# Altium project PROC099A.PrjPcb (part 2 of 3)

## Sheet PROC099A_SOP_Headers_Reference.SchDoc
size 431 x 279 mm; Date: Not shown in title block; ApprovedBy: Not shown in title block; CheckedBy: Not shown in title block; Author: Not shown in title block; CompanyName: Not shown in title block; DrawnBy: Adrian Ozer; Engineer: Not shown in title block; Organization: Not shown in title block; Address1: Not shown in title block; Address2: Not shown in title block; Address3: Not shown in title block; Address4: Not shown in title block; DocumentNumber: 6; Revision: Use project parameter SCH_Rev; SheetNumber: 6; SheetTotal: 16; PageSetup: Record=PageOptions|CenterHorizontal=True|CenterVertical=True|PrintScale=1.00|XCorrection=1.00|YCorrection=1.00|PrintKind=0|BorderSize=5000000|LeftOffset=0|BottomOffset=0|Orientation=2|PaperLength=1000|PaperWidth=1000|Scale=100|PaperSource=15|PrintQuality=600|MediaType=1|DitherType=10|PaperKind=Letter|PrintScaleMode=1; CurrentTime: Not shown in title block; CurrentDate: Not shown in title block; Time: Not shown in title block; DocumentFullPathAndName: Not shown in title block; DocumentName: Not shown in title block; ModifiedDate: Not shown in title block; ImagePath: Not shown in title block
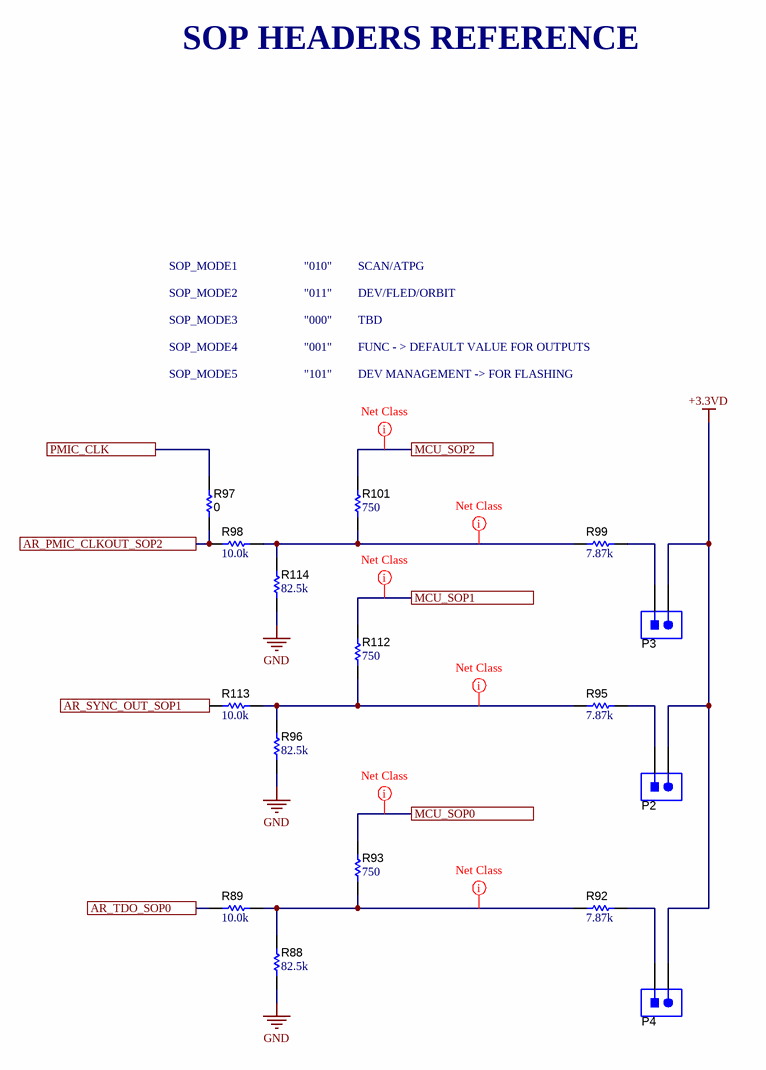
[diagram p4: PROC099A_SOP_Headers_Reference.SchDoc]

### Parts
P2  TSW-102-07-G-S  [TSW-102-07-G-S]  (value not drawn)
P3  TSW-102-07-G-S  [TSW-102-07-G-S]  (value not drawn)
P4  TSW-102-07-G-S  [TSW-102-07-G-S]  (value not drawn)
R88  ValueDisplayed: 82.5k  [0402L]  (hidden comment: CRCW040282K5FKED)
R89  ValueDisplayed: 10.0k  [0402L]  (hidden comment: CRCW040210K0FKED)
R92  ValueDisplayed: 7.87k  [0402L]  (hidden comment: CRCW04027K87FKED)
R93  ValueDisplayed: 750  [0402L]  (hidden comment: CRCW0402750RFKED)
R95  ValueDisplayed: 7.87k  [0402L]  (hidden comment: CRCW04027K87FKED)
R96  ValueDisplayed: 82.5k  [0402L]  (hidden comment: CRCW040282K5FKED)
R97  ValueDisplayed: 0  [0402L]  (hidden comment: ERJ-2GE0R00X)
R98  ValueDisplayed: 10.0k  [0402L]  (hidden comment: CRCW040210K0FKED)
R99  ValueDisplayed: 7.87k  [0402L]  (hidden comment: CRCW04027K87FKED)
R101  ValueDisplayed: 750  [0402L]  (hidden comment: CRCW0402750RFKED)
R112  ValueDisplayed: 750  [0402L]  (hidden comment: CRCW0402750RFKED)
R113  ValueDisplayed: 10.0k  [0402L]  (hidden comment: CRCW040210K0FKED)
R114  ValueDisplayed: 82.5k  [0402L]  (hidden comment: CRCW040282K5FKED)

### Ports
AR_PMIC_CLKOUT_SOP2, AR_SYNC_OUT_SOP1, AR_TDO_SOP0, MCU_SOP0, MCU_SOP1, MCU_SOP2, PMIC_CLK

### Nets
+3.3VD: P2.2 P3.2 P4.2
GND: R88.1 R96.1 R114.1
AR_PMIC_CLKOUT_SOP2: R97.1 R98.1 ; port AR_PMIC_CLKOUT_SOP2
AR_SYNC_OUT_SOP1: R113.1 ; port AR_SYNC_OUT_SOP1
AR_TDO_SOP0: R89.1 ; port AR_TDO_SOP0
MCU_SOP0: R93.2 ; port MCU_SOP0
MCU_SOP1: R112.2 ; port MCU_SOP1
MCU_SOP2: R101.2 ; port MCU_SOP2
PMIC_CLK: R97.2 ; port PMIC_CLK
NetP2_1: P2.1 R95.2
NetP3_1: P3.1 R99.2
NetP4_1: P4.1 R92.2
NetR88_2: R88.2 R89.2 R92.1 R93.1
NetR95_1: R95.1 R96.2 R112.1 R113.2
NetR98_2: R98.2 R99.1 R101.1 R114.2

### Layout directives
net class GENERAL: MCU_SOP0, MCU_SOP1, MCU_SOP2, NetR88_2, NetR95_1, NetR98_2

### Notes on the sheet
- SOP HEADERS REFERENCE
- SOP_MODE1
- "010"
- SCAN/ATPG
- SOP_MODE2
- SOP_MODE3
- "011"
- "000"
- DEV/FLED/ORBIT
- TBD
- SOP_MODE4
- SOP_MODE5
- "001"
- "101"
- FUNC - > DEFAULT VALUE FOR OUTPUTS
- DEV MANAGEMENT -> FOR FLASHING
- Drawn By:
- SVN Rev:
- Number:
- TID #:
- Orderable:
- Rev:
- Sheet Title:
- File:
- Project Title:
- Designed for:
- Assembly Variant:
- Mod. Date:
- Sheet:
- Size:
- of
- B
- http://www.ti.com
- Texas Instruments and/or its licensors do not warrant the accuracy or completeness of this specification or any information contained therein. Texas Instruments and/or its licensors do not warrant that this design will meet the specifications, will be suitable for your application or fit for any particular purpose, or will operate in an implementation. Texas Instruments and/or its licensors do not warrant that the design is production worthy. You should completely validate and test your design implementation to confirm the system functionality for your application.
- Engineer:
- Contact:
- © Texas Instruments

### Library data of the parts
P2-P4 = CMP-0075405-2: Header, 100mil, 2x1, Gold, TH; Manufacturer: Samtec; Pitch_mm: 2.54; Cert_VDE: N; Gender: Male; Cert_CSA: Y; Voltage_V: 550V; Green_REACh: Passed; Current_A: 6.3A; Green_Lifecycle: Active; Row_Count: 1; ComponentLink1Description: Datasheet URL; RoHS: Y; Supplier 1: Digi-Key; Cert_UL: Y; Orientation: Vertical; Green_EU RoHS: Passed; PackageReference: 2x1 Header; Color: Black; PartNumber: TSW-102-07-G-S; PinCount: 2; ContactFinish: Gold; Cert_CULUS: N; Shrouded: N; ClassName: Header; ComponentLink1URL: http://samtec.com/ftppub/pdf/TSW_TH.PDF; CompType: Header; MountType: TH; Supplier Part Number 1: SAM1029-02-ND; Green_EU RoHS-2: Passed
R88 R96 = CMP-0026574-2: RES, 82.5 k, 1%, 0.063 W, AEC-Q200 Grade 0, 0402; Manufacturer: Vishay-Dale; Power_W: 63mW; TempCo: 100 ppm/C; Value_Code: 82k5; Value: 82.5k; EIA_Code: E96; SizeX_mm: 1; SizeY_mm: 0.5; SizeZ_mm: 0.6; Value2: 0.063W; AEC Qualified: Y; VDC_V: 50V; AEC Grade: 0; AEC Category: Q200; ComponentLink1URL: http://www.vishay.com/docs/20035/dcrcwe3.pdf; Supplier Part Number 2: 52K7304; Supplier 2: Newark; Supplier Part Number 3: 71-CRCW0402-82.5K-E3; Supplier 3: Mouser; RoHS: E; Value1: 1%; MountType: SMT; Supplier 1: Digi-Key; PackageReference: 0402; Tolerance_%: 1%; Res_ohm: 82.5k; SizeArea_mm2: 0.5; CompType: Resistor; PartNumber: CRCW040282K5FKED; ComponentLink1Description: Datasheet link; Supplier Part Number 1: 541-82.5KLCT-ND; Technology: Thick Film
R89 R98 R113 = CMP-0025958-3: RES, 10.0 k, 1%, 0.063 W, AEC-Q200 Grade 0, 0402; Manufacturer: Vishay-Dale; Power_W: 63mW; TempCo: 100 ppm/C; Value_Code: 10k0; Value: 10.0k; EIA_Code: E96; Res_ohm: 10k; SizeX_mm: 1; SizeY_mm: 0.5; SizeZ_mm: 0.6; Value2: 0.063W; CompType: Resistor; AEC Qualified: Y; VDC_V: 50V; AEC Category: Q200; AEC Grade: 0; Supplier Part Number 2: 52K6595; Supplier 2: Newark; Supplier Part Number 3: 71-CRCW0402-10K-E3; Supplier 3: Mouser; RoHS: E; Value1: 1%; MountType: SMT; Supplier 1: Digi-Key; PackageReference: 0402; Tolerance_%: 1%; SizeArea_mm2: 0.5; PartNumber: CRCW040210K0FKED; ComponentLink1Description: Datasheet link; Supplier Part Number 1: 541-10.0KLCT-ND; Technology: Thick Film; ComponentLink1URL: http://www.vishay.com/docs/20035/dcrcwe3.pdf
R92 R95 R99 = CMP-0026557-2: RES, 7.87 k, 1%, 0.063 W, AEC-Q200 Grade 0, 0402; Manufacturer: Vishay-Dale; Power_W: 63mW; TempCo: 100 ppm/C; Value_Code: 7k87; Value: 7.87k; EIA_Code: E96; SizeX_mm: 1; SizeY_mm: 0.5; SizeZ_mm: 0.6; Value2: 0.063W; AEC Qualified: Y; VDC_V: 50V; AEC Grade: 0; AEC Category: Q200; ComponentLink1URL: http://www.vishay.com/docs/20035/dcrcwe3.pdf; Supplier Part Number 2: 52K7249; Supplier 2: Newark; Supplier Part Number 3: 71-CRCW0402-7.87K-E3; Supplier 3: Mouser; RoHS: E; Value1: 1%; MountType: SMT; Supplier 1: Digi-Key; PackageReference: 0402; Tolerance_%: 1%; Res_ohm: 7.87k; SizeArea_mm2: 0.5; CompType: Resistor; PartNumber: CRCW04027K87FKED; ComponentLink1Description: Datasheet link; Supplier Part Number 1: 541-7.87KLCT-ND; Technology: Thick Film
R93 R112 = CMP-0026542-2: RES, 750, 1%, 0.063 W, AEC-Q200 Grade 0, 0402; Manufacturer: Vishay-Dale; Power_W: 63mW; TempCo: 100 ppm/C; Value_Code: 750R; Value: 750; EIA_Code: E96; SizeX_mm: 1; SizeY_mm: 0.5; SizeZ_mm: 0.6; Value2: 0.063W; AEC Qualified: Y; VDC_V: 50V; AEC Grade: 0; AEC Category: Q200; ComponentLink1URL: http://www.vishay.com/docs/20035/dcrcwe3.pdf; Supplier Part Number 2: 52K7270; Supplier 2: Newark; Supplier Part Number 3: 71-CRCW0402-750-E3; Supplier 3: Mouser; RoHS: E; Value1: 1%; MountType: SMT; Supplier 1: Digi-Key; PackageReference: 0402; Tolerance_%: 1%; Res_ohm: 750; SizeArea_mm2: 0.5; CompType: Resistor; PartNumber: CRCW0402750RFKED; ComponentLink1Description: Datasheet link; Supplier Part Number 1: 541-750LCT-ND; Technology: Thick Film
R97 = CMP-0026992-2: RES, 0, 5%, 0.063 W, 0402; Manufacturer: Panasonic; Power_W: 63mW; TempCo: 600 ppm/C; Value_Code: 0000; U/M: EA; Value: 0; EIA_Code: E24; SizeX_mm: 1; SizeY_mm: 0.5; SizeZ_mm: 0.6; Value2: 0.063W; CompType: Resistor; VDC_V: 50V; AEC Category: Q200; INSTALATION: DNP; Supplier Part Number 2: 65T8307; Publisher: Texas Instruments; Supplier 2: Newark; Supplier Part Number 3: 667-ERJ-2GE0R00X; Supplier 3: Mouser; Published: 2008-06-26; RoHS: Y; Value1: 5%; MountType: SMT; Supplier 1: Digi-Key; PackageReference: 0402; Tolerance_%: 5%; Res_ohm: 0; SizeArea_mm2: 0.5; LatestRevisionDate: 2017-03-09; PartNumber: ERJ-2GE0R00X; AEC Qualified: ?; ComponentLink1Description: Datasheet link; Supplier Part Number 1: P0.0JCT-ND; Technology: Thick Film; ComponentLink1URL: http://www.panasonic.com/industrial/components/pdf/AOA0000CE1.pdf
R101 = CMP-0026542-2: RES, 750, 1%, 0.063 W, AEC-Q200 Grade 0, 0402; Manufacturer: Vishay-Dale; Power_W: 63mW; TempCo: 100 ppm/C; Value_Code: 750R; Value: 750; EIA_Code: E96; SizeX_mm: 1; SizeY_mm: 0.5; SizeZ_mm: 0.6; Value2: 0.063W; CompType: Resistor; AEC Qualified: Y; VDC_V: 50V; AEC Grade: 0; AEC Category: Q200; ComponentLink1URL: http://www.vishay.com/docs/20035/dcrcwe3.pdf; Supplier Part Number 2: 52K7270; Supplier 2: Newark; Supplier Part Number 3: 71-CRCW0402-750-E3; Supplier 3: Mouser; RoHS: E; Value1: 1%; MountType: SMT; Supplier 1: Digi-Key; PackageReference: 0402; Tolerance_%: 1%; Res_ohm: 750; SizeArea_mm2: 0.5; PartNumber: CRCW0402750RFKED; ComponentLink1Description: Datasheet link; Supplier Part Number 1: 541-750LCT-ND; Technology: Thick Film
R114 = CMP-0026574-2: RES, 82.5 k, 1%, 0.063 W, AEC-Q200 Grade 0, 0402; Manufacturer: Vishay-Dale; Power_W: 63mW; TempCo: 100 ppm/C; Value_Code: 82k5; Value: 82.5k; EIA_Code: E96; SizeX_mm: 1; SizeY_mm: 0.5; SizeZ_mm: 0.6; Value2: 0.063W; CompType: Resistor; AEC Qualified: Y; VDC_V: 50V; AEC Grade: 0; AEC Category: Q200; ComponentLink1URL: http://www.vishay.com/docs/20035/dcrcwe3.pdf; Supplier Part Number 2: 52K7304; Supplier 2: Newark; Supplier Part Number 3: 71-CRCW0402-82.5K-E3; Supplier 3: Mouser; RoHS: E; Value1: 1%; MountType: SMT; Supplier 1: Digi-Key; PackageReference: 0402; Tolerance_%: 1%; Res_ohm: 82.5k; SizeArea_mm2: 0.5; PartNumber: CRCW040282K5FKED; ComponentLink1Description: Datasheet link; Supplier Part Number 1: 541-82.5KLCT-ND; Technology: Thick Film

## Sheet PROC099A_QSPI_Flash_Reference.SchDoc: QSPI flash section
size 431 x 279 mm; Date: Not shown in title block; ApprovedBy: Not shown in title block; CheckedBy: Not shown in title block; Author: Not shown in title block; CompanyName: Not shown in title block; DrawnBy: Adrian Ozer; Engineer: Not shown in title block; Organization: Not shown in title block; Address1: Not shown in title block; Address2: Not shown in title block; Address3: Not shown in title block; Address4: Not shown in title block; DocumentNumber: 7; Revision: Use project parameter SCH_Rev; SheetNumber: 7; SheetTotal: 16; PageSetup: Record=PageOptions|CenterHorizontal=True|CenterVertical=True|PrintScale=1.00|XCorrection=1.00|YCorrection=1.00|PrintKind=0|BorderSize=5000000|LeftOffset=0|BottomOffset=0|Orientation=2|PaperLength=1000|PaperWidth=1000|Scale=100|PaperSource=15|PrintQuality=600|MediaType=1|DitherType=10|PaperKind=Letter|PrintScaleMode=1; CurrentTime: Not shown in title block; CurrentDate: Not shown in title block; Time: Not shown in title block; DocumentFullPathAndName: Not shown in title block; DocumentName: Not shown in title block; ModifiedDate: Not shown in title block; ImagePath: Not shown in title block
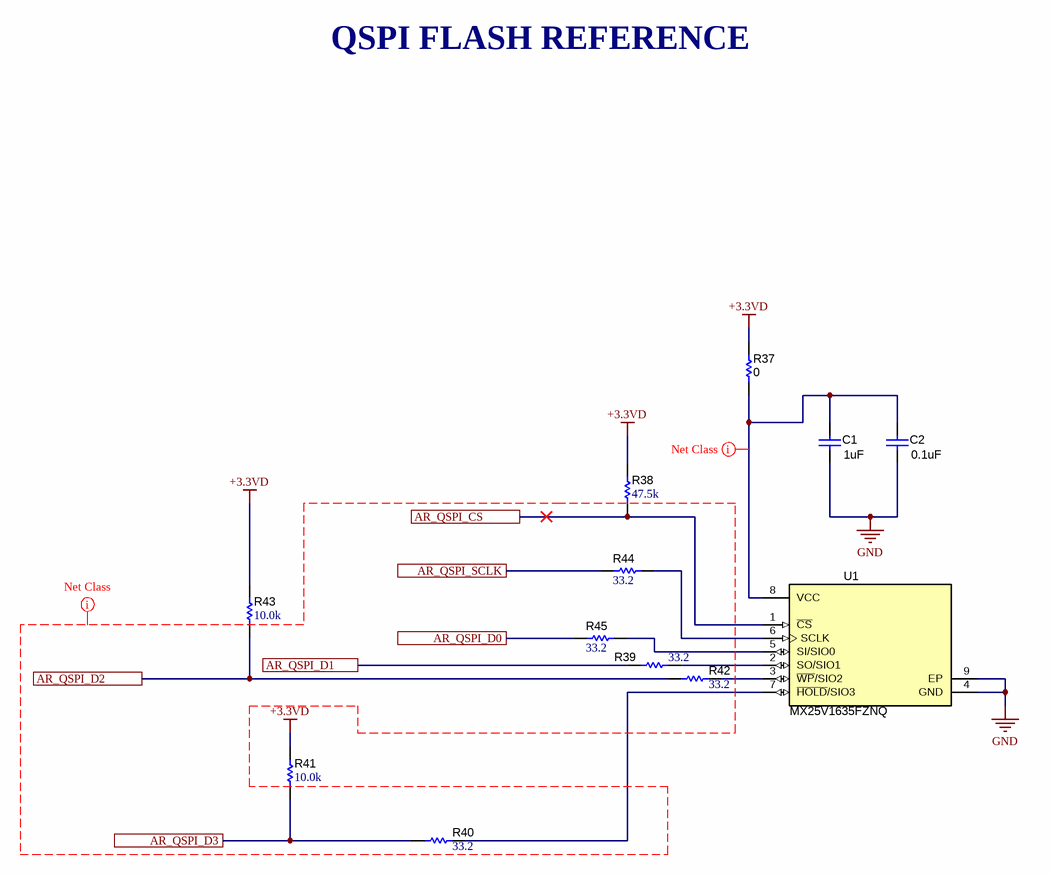
[diagram p5: PROC099A_QSPI_Flash_Reference.SchDoc]

### Parts
C1  ValueDisplayed: 1uF  [0603]  (hidden comment: GCM188R71C105KA64D)
C2  ValueDisplayed: 0.1uF  [0402L]  (hidden comment: CGA2B3X7R1H104K050BB)
R37  ValueDisplayed: 0  [0402L]  (hidden comment: ERJ-2GE0R00X)
R38  ValueDisplayed: 47.5k  [0402L]  (hidden comment: CRCW040247K5FKED)
R39  ValueDisplayed: 33.2  [0201_Silk]  (hidden comment: CRCW020133R2FNED)
R40  ValueDisplayed: 33.2  [0201_Silk]  (hidden comment: CRCW020133R2FNED)
R41  ValueDisplayed: 10.0k  [0402L]  (hidden comment: CRCW040210K0FKED)
R42  ValueDisplayed: 33.2  [0201_Silk]  (hidden comment: CRCW020133R2FNED)
R43  ValueDisplayed: 10.0k  [0402L]  (hidden comment: CRCW040210K0FKED)
R44  ValueDisplayed: 33.2  [0201_Silk]  (hidden comment: CRCW020133R2FNED)
R45  ValueDisplayed: 33.2  [0201_Silk]  (hidden comment: CRCW020133R2FNED)
U1  MX25V1635FZNQ  [WSON-8L_6x5MM_EP]

### Ports
AR_QSPI_CS, AR_QSPI_D0, AR_QSPI_D1, AR_QSPI_D2, AR_QSPI_D3, AR_QSPI_SCLK

### Nets
+3.3VD: R37.1 R38.2 R41.2 R43.2
GND: C1.1 C2.1 U1.4(GND) U1.9(EP)
AR_QSPI_CS: R38.1 U1.1(~{CS}) ; port AR_QSPI_CS
AR_QSPI_D0: R45.2 ; port AR_QSPI_D0
AR_QSPI_D1: R39.1 ; port AR_QSPI_D1
AR_QSPI_D2: R42.1 R43.1 ; port AR_QSPI_D2
AR_QSPI_D3: R40.2 R41.1 ; port AR_QSPI_D3
AR_QSPI_SCLK: R44.2 ; port AR_QSPI_SCLK
NetC1_2: C1.2 C2.2 R37.2 U1.8(VCC)
NetR39_2: R39.2 U1.2(SO/SIO1)
NetR40_1: R40.1 U1.7(~{HOLD}/SIO3)
NetR42_2: R42.2 U1.3(~{WP}/SIO2)
NetR44_1: R44.1 U1.6(SCLK)
NetR45_1: R45.1 U1.5(SI/SIO0)

### Layout directives
net class PWR: NetC1_2
net class QSPI: +3.3VD

### Notes on the sheet
- QSPI FLASH REFERENCE
- Drawn By:
- SVN Rev:
- Number:
- TID #:
- Orderable:
- Rev:
- Sheet Title:
- File:
- Project Title:
- Designed for:
- Assembly Variant:
- Mod. Date:
- Sheet:
- Size:
- of
- B
- http://www.ti.com
- Texas Instruments and/or its licensors do not warrant the accuracy or completeness of this specification or any information contained therein. Texas Instruments and/or its licensors do not warrant that this design will meet the specifications, will be suitable for your application or fit for any particular purpose, or will operate in an implementation. Texas Instruments and/or its licensors do not warrant that the design is production worthy. You should completely validate and test your design implementation to confirm the system functionality for your application.
- Engineer:
- Contact:
- © Texas Instruments

### Library data of the parts
C1 = CMP-0007136-5: CAP, CERM, 1 uF, 16 V, +/- 10%, X7R, AEC-Q200 Grade 1, 0603; Manufacturer: MuRata; TaMin_C: -55°C; Polarized: N; SizeAreaWB_mm2: 4.68; Value1: Unknown; U/M: EA; Value: 1uF; TaMax_C: 125°C; SizeZ_mm: 1; SizeX_mm: 1.6; SizeY_mm: 0.8; Value2: 16V; SizeArea_mm2: 1.28; AEC Qualified: Y; Cap_F: 1µF; AEC Category: Q200; Supplier Part Number 2: 81-GCM188R71C105K64D; Publisher: Texas Instruments; Supplier 2: Mouser; TempCo: X7R; Published: 2008-06-19; RoHS: Y; MountType: SMT; Supplier 1: Digi-Key; PackageReference: 0603; Tolerance_%: 10%; Cap_Case: 0603; CompType: Capacitor; LatestRevisionDate: 2017-03-09; PartNumber: GCM188R71C105KA64D; VDC_V: 16V; ComponentLink1Description: Datasheet link; AEC Grade: 1; Supplier Part Number 1: 490-5241-6-ND; Technology: Ceramic; ComponentLink1URL: http://psearch.en.murata.com/capacitor/product/GCM188R71C105KA64%23.pdf
C2 = CMP-0006325-2: CAP, CERM, 0.1 uF, 50 V, +/- 10%, X7R, AEC-Q200 Grade 1, 0402; Manufacturer: TDK; TaMin_C: -55°C; ESR_ohm: 0.039064; Polarized: N; SizeAreaWB_mm2: 3; Value1: 0.039064 ohm; U/M: EA; Value: 0.1uF; TaMax_C: 125°C; SizeZ_mm: 0.6; SizeX_mm: 1; SizeY_mm: 0.5; Cap_Case: 0402; Value2: 50V; AEC Qualified: Y; Cap_F: 100nF; IRMS_A: 8.14669dA; AEC Category: Q200; Supplier Part Number 2: 04X3148; Publisher: Texas Instruments; Supplier 2: Newark; Supplier Part Number 3: 810-CGA2B3X7R1H104K; TempCo: X7R; Supplier 3: Mouser; Published: 2008-06-19; RoHS: Y; MountType: SMT; Supplier 1: Digi-Key; PackageReference: 0402; Tolerance_%: 10%; SizeArea_mm2: 0.5; CompType: Capacitor; LatestRevisionDate: 2017-03-09; PartNumber: CGA2B3X7R1H104K050BB; VDC_V: 50V; ComponentLink1Description: Datasheet link; AEC Grade: 1; Supplier Part Number 1: 445-6899-1-ND; Technology: Ceramic; ComponentLink1URL: https://product.tdk.com/en/search/capacitor/ceramic/mlcc/info?part_no=CGA2B3X7R1H104K050BB
R37 = CMP-0026992-2: RES, 0, 5%, 0.063 W, 0402; Manufacturer: Panasonic; Power_W: 63mW; TempCo: 600 ppm/C; Value_Code: 0000; U/M: EA; Value: 0; EIA_Code: E24; SizeX_mm: 1; SizeY_mm: 0.5; SizeZ_mm: 0.6; Value2: 0.063W; VDC_V: 50V; AEC Category: Q200; Supplier Part Number 2: 65T8307; Publisher: Texas Instruments; Supplier 2: Newark; Supplier Part Number 3: 667-ERJ-2GE0R00X; Supplier 3: Mouser; Published: 2008-06-26; RoHS: Y; Value1: 5%; MountType: SMT; Supplier 1: Digi-Key; PackageReference: 0402; Tolerance_%: 5%; Res_ohm: 0; SizeArea_mm2: 0.5; CompType: Resistor; LatestRevisionDate: 2017-03-09; PartNumber: ERJ-2GE0R00X; AEC Qualified: ?; ComponentLink1Description: Datasheet link; Supplier Part Number 1: P0.0JCT-ND; Technology: Thick Film; ComponentLink1URL: http://www.panasonic.com/industrial/components/pdf/AOA0000CE1.pdf
R38 = CMP-0026395-2: RES, 47.5 k, 1%, 0.063 W, AEC-Q200 Grade 0, 0402; Manufacturer: Vishay-Dale; Power_W: 63mW; TempCo: 100 ppm/C; Value_Code: 47k5; Value: 47.5k; EIA_Code: E96; SizeX_mm: 1; SizeY_mm: 0.5; SizeZ_mm: 0.6; Value2: 0.063W; AEC Qualified: Y; VDC_V: 50V; AEC Category: Q200; AEC Grade: 0; ComponentLink1URL: http://www.vishay.com/docs/20035/dcrcwe3.pdf; Supplier Part Number 2: 52K7100; Supplier 2: Newark; Supplier Part Number 3: 71-CRCW0402-47.5K-E3; Supplier 3: Mouser; RoHS: E; Value1: 1%; MountType: SMT; Supplier 1: Digi-Key; PackageReference: 0402; Tolerance_%: 1%; Res_ohm: 47.5k; SizeArea_mm2: 0.5; CompType: Resistor; PartNumber: CRCW040247K5FKED; ComponentLink1Description: Datasheet link; Supplier Part Number 1: 541-47.5KLCT-ND; Technology: Thick Film
R39 R40 R42 R44 R45 = CMP-0027275-3: RES, 33.2, 1%, 0.05 W, 0201; Manufacturer: Vishay-Dale; Power_W: 50mW; TempCo: 200 ppm/C; Value_Code: 33R2; Value: 33.2; EIA_Code: E96; SizeX_mm: 0.6; SizeY_mm: 0.3; SizeZ_mm: 0.26; Value2: 0.05W; SizeArea_mm2: 0.18; AEC Qualified: N; AEC Category: Q200; Supplier Part Number 2: 26W8649; Supplier 2: Newark; Supplier Part Number 3: 71-CRCW020133R2FNED; Supplier 3: Mouser; RoHS: E; Value1: 1%; MountType: SMT; Supplier 1: Digi-Key; PackageReference: 0201; Tolerance_%: 1%; Res_ohm: 33.2; CompType: Resistor; PartNumber: CRCW020133R2FNED; ComponentLink1Description: Datasheet link; AEC Grade: N/A; Supplier Part Number 1: 541-33.2ABCT-ND; Technology: Thick Film; ComponentLink1URL: http://www.vishay.com/docs/20052/crcw0201e3.pdf
R41 R43 = CMP-0025958-3: RES, 10.0 k, 1%, 0.063 W, AEC-Q200 Grade 0, 0402; Manufacturer: Vishay-Dale; Power_W: 63mW; TempCo: 100 ppm/C; Value_Code: 10k0; Value: 10.0k; EIA_Code: E96; Res_ohm: 10k; SizeX_mm: 1; SizeY_mm: 0.5; SizeZ_mm: 0.6; Value2: 0.063W; AEC Qualified: Y; VDC_V: 50V; AEC Category: Q200; AEC Grade: 0; Supplier Part Number 2: 52K6595; Supplier 2: Newark; Supplier Part Number 3: 71-CRCW0402-10K-E3; Supplier 3: Mouser; RoHS: E; Value1: 1%; MountType: SMT; Supplier 1: Digi-Key; PackageReference: 0402; Tolerance_%: 1%; SizeArea_mm2: 0.5; CompType: Resistor; PartNumber: CRCW040210K0FKED; ComponentLink1Description: Datasheet link; Supplier Part Number 1: 541-10.0KLCT-ND; Technology: Thick Film; ComponentLink1URL: http://www.vishay.com/docs/20035/dcrcwe3.pdf
U1 = CMP-0079267-1: 2.3V-3.6V, 16M-BIT [x 1/x 2/x 4] CMOS FLASH Memory, WSON-8; Manufacturer: Macronix International Co., LTD; SizeArea_mm2: 30; SizeAreaWB_mm2: 56; SizeY_mm: 5; SizeZ_mm: 0.8; SizeX_mm: 6; PartNumber: MX25V1635FZNQ; PackageReference: WSON-8; Supplier Part Number 1: 1092-1211-ND; ComponentLink1Description: Datasheet URL; MountType: SMT; ComponentLink1URL: http://www.macronix.com/Lists/Datasheet/Attachments/6724/MX25V1635F,%202.5V,%2016Mb,%20v1.4.pdf; Supplier 1: Digi-Key; RoHS: Y

## Sheet PROC099A_HD Connector.SchDoc: HD Connector
size 431 x 279 mm; Date: Not shown in title block; ApprovedBy: Not shown in title block; CheckedBy: Not shown in title block; Author: Not shown in title block; CompanyName: Not shown in title block; DrawnBy: Adrian Ozer; Engineer: Not shown in title block; Organization: Not shown in title block; Address1: Not shown in title block; Address2: Not shown in title block; Address3: Not shown in title block; Address4: Not shown in title block; DocumentNumber: 10; Revision: Use project parameter SCH_Rev; SheetNumber: 10; SheetTotal: 16; PageSetup: Record=PageOptions|CenterHorizontal=True|CenterVertical=True|PrintScale=1.00|XCorrection=1.00|YCorrection=1.00|PrintKind=0|BorderSize=5000000|LeftOffset=0|BottomOffset=0|Orientation=2|PaperLength=1000|PaperWidth=1000|Scale=100|PaperSource=15|PrintQuality=600|MediaType=1|DitherType=10|PrintScaleMode=1|PaperKind=Letter; CurrentTime: Not shown in title block; CurrentDate: Not shown in title block; Time: Not shown in title block; DocumentFullPathAndName: Not shown in title block; DocumentName: Not shown in title block; ModifiedDate: Not shown in title block; ImagePath: Not shown in title block
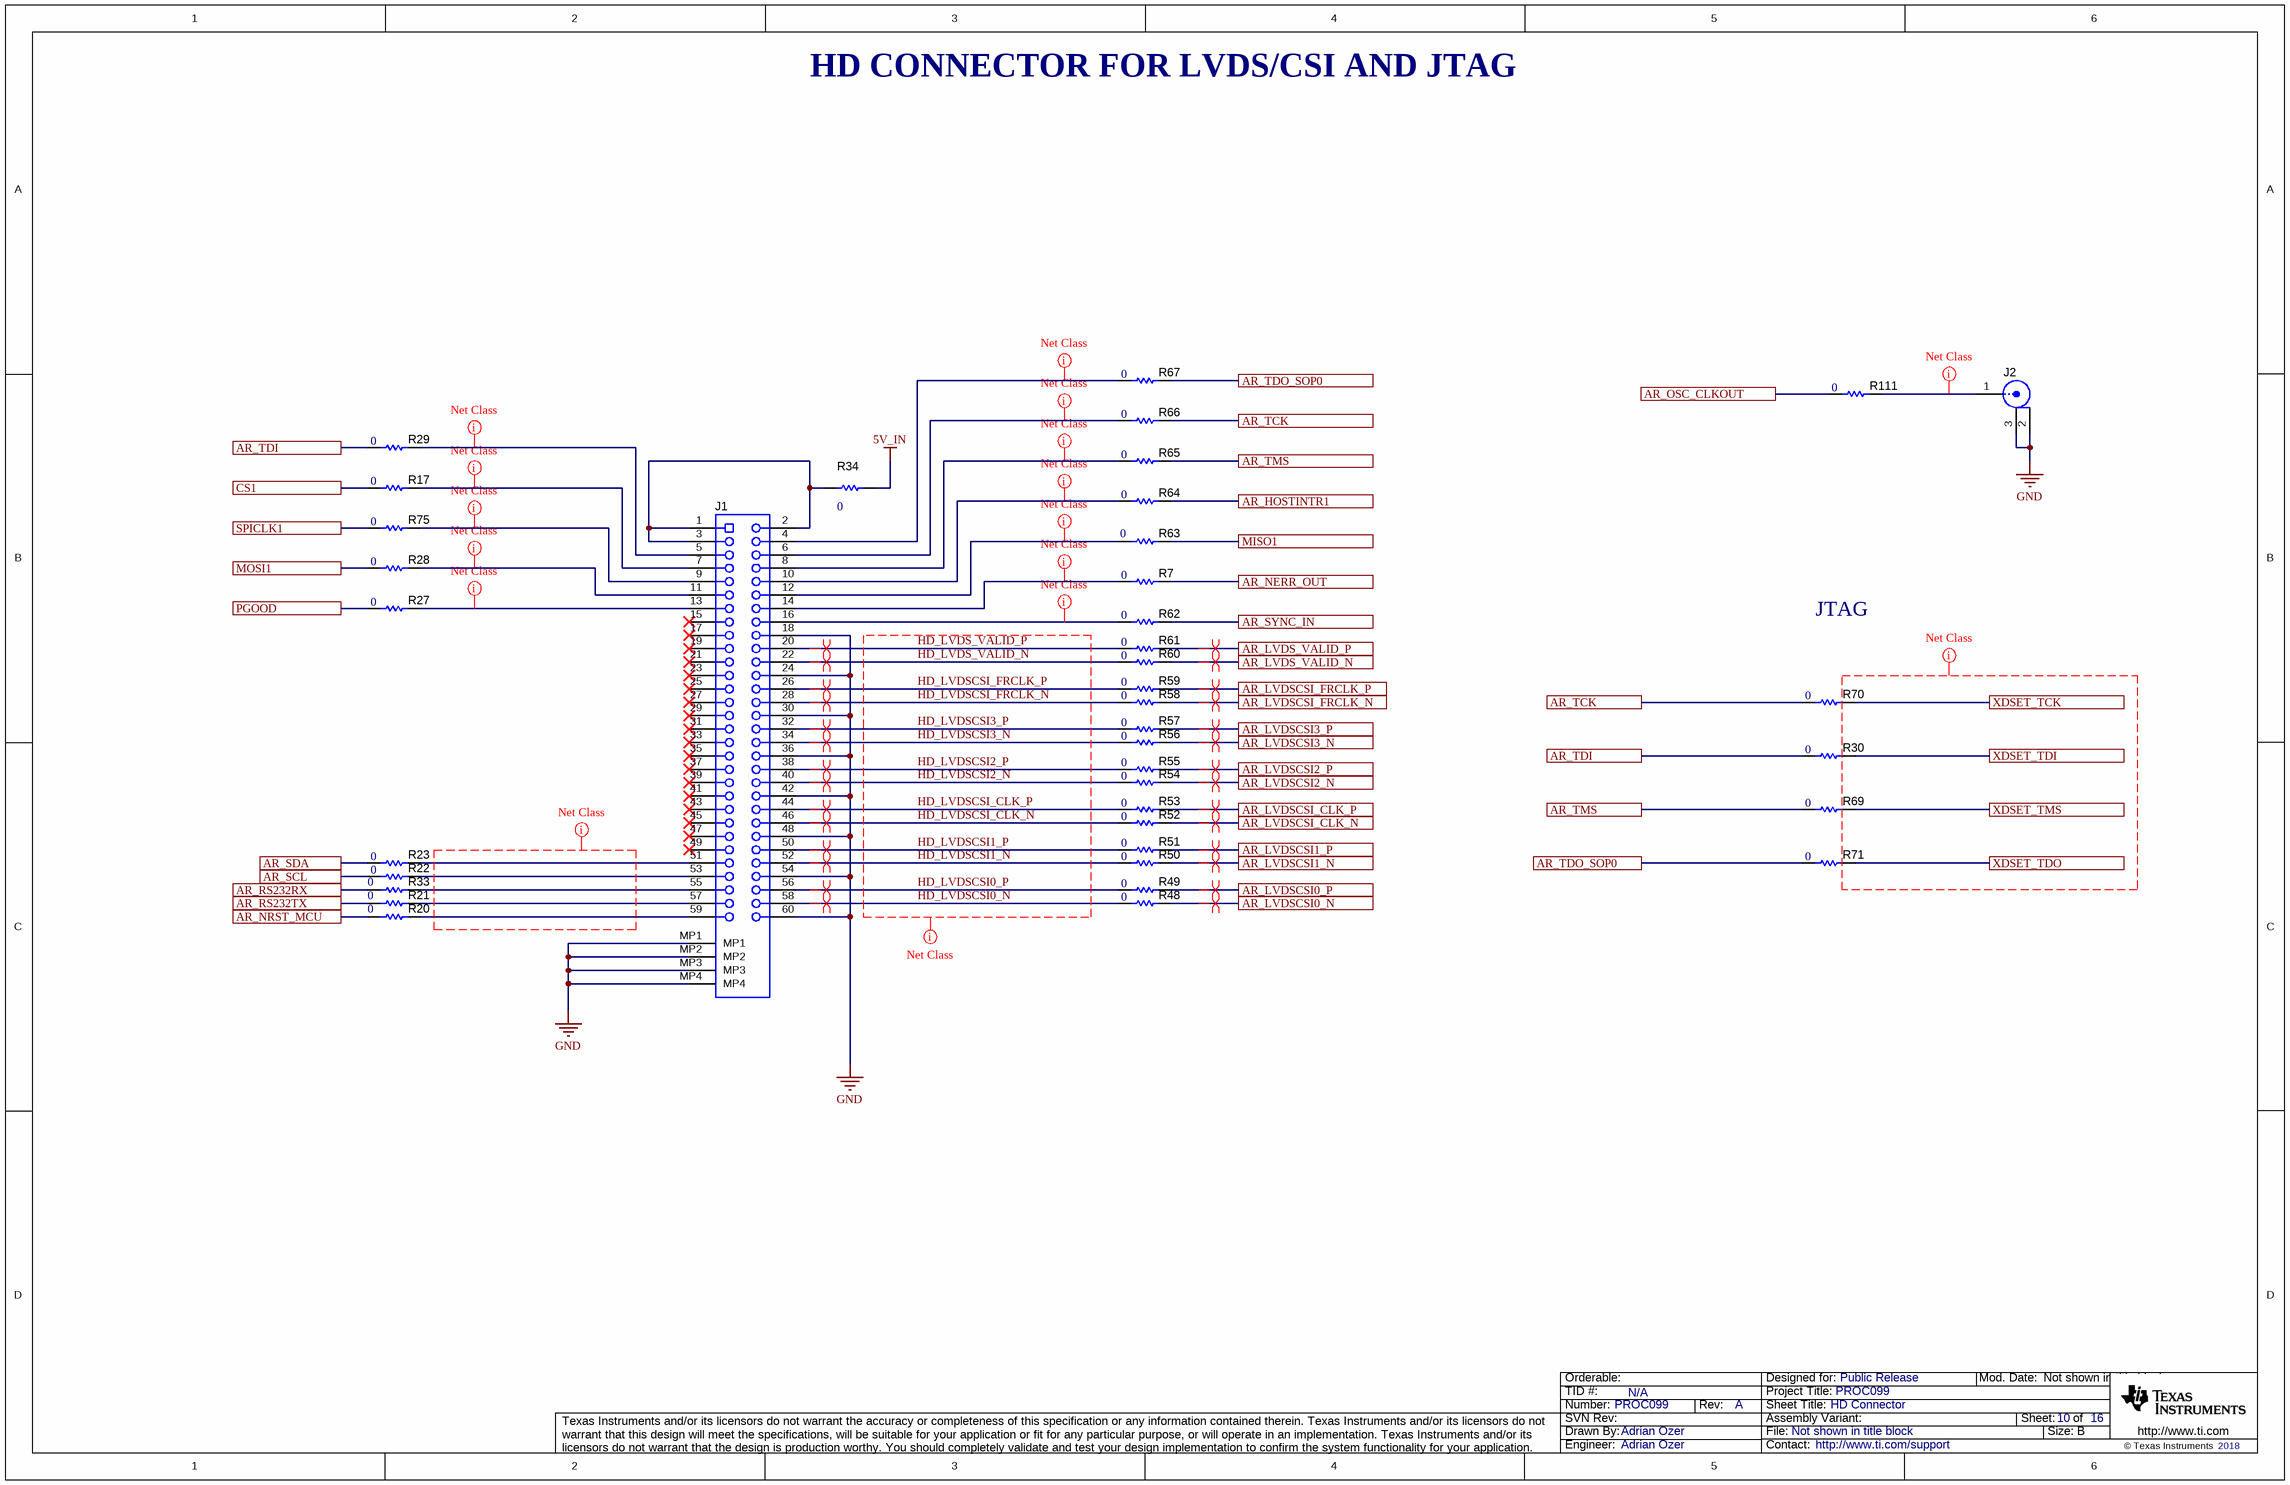
[diagram p6: PROC099A_HD Connector.SchDoc]

### Parts
J1  QSH-030-01-L-D-A  [Samtec_QSH-030-01-X-D-A]  (value not drawn)
J2  128-0711-201  [Johnson_128-0711-201]  (value not drawn)
R7  ValueDisplayed: 0  [0201_Silk]  (hidden comment: CRCW02010000Z0ED)
R17  ValueDisplayed: 0  [0201_Silk]  (hidden comment: CRCW02010000Z0ED)
R20  ValueDisplayed: 0  [0201_Silk]  (hidden comment: CRCW02010000Z0ED)
R21  ValueDisplayed: 0  [0201_Silk]  (hidden comment: CRCW02010000Z0ED)
R22  ValueDisplayed: 0  [0201_Silk]  (hidden comment: CRCW02010000Z0ED)
R23  ValueDisplayed: 0  [0201_Silk]  (hidden comment: CRCW02010000Z0ED)
R27  ValueDisplayed: 0  [0201_Silk]  (hidden comment: CRCW02010000Z0ED)
R28  ValueDisplayed: 0  [0201_Silk]  (hidden comment: CRCW02010000Z0ED)
R29  ValueDisplayed: 0  [0201_Silk]  (hidden comment: CRCW02010000Z0ED)
R30  ValueDisplayed: 0  [0201_Silk]  (hidden comment: CRCW02010000Z0ED)
R33  ValueDisplayed: 0  [0201_Silk]  (hidden comment: CRCW02010000Z0ED)
R34  ValueDisplayed: 0  [2010L]  (hidden comment: CRCW20100000Z0EF)
R48  ValueDisplayed: 0  [0201_Silk]  (hidden comment: CRCW02010000Z0ED)
R49  ValueDisplayed: 0  [0201_Silk]  (hidden comment: CRCW02010000Z0ED)
R50  ValueDisplayed: 0  [0201_Silk]  (hidden comment: CRCW02010000Z0ED)
R51  ValueDisplayed: 0  [0201_Silk]  (hidden comment: CRCW02010000Z0ED)
R52  ValueDisplayed: 0  [0201_Silk]  (hidden comment: CRCW02010000Z0ED)
R53  ValueDisplayed: 0  [0201_Silk]  (hidden comment: CRCW02010000Z0ED)
R54  ValueDisplayed: 0  [0201_Silk]  (hidden comment: CRCW02010000Z0ED)
R55  ValueDisplayed: 0  [0201_Silk]  (hidden comment: CRCW02010000Z0ED)
R56  ValueDisplayed: 0  [0201_Silk]  (hidden comment: CRCW02010000Z0ED)
R57  ValueDisplayed: 0  [0201_Silk]  (hidden comment: CRCW02010000Z0ED)
R58  ValueDisplayed: 0  [0201_Silk]  (hidden comment: CRCW02010000Z0ED)
R59  ValueDisplayed: 0  [0201_Silk]  (hidden comment: CRCW02010000Z0ED)
R60  ValueDisplayed: 0  [0201_Silk]  (hidden comment: CRCW02010000Z0ED)
R61  ValueDisplayed: 0  [0201_Silk]  (hidden comment: CRCW02010000Z0ED)
R62  ValueDisplayed: 0  [0201_Silk]  (hidden comment: CRCW02010000Z0ED)
R63  ValueDisplayed: 0  [0201_Silk]  (hidden comment: CRCW02010000Z0ED)
R64  ValueDisplayed: 0  [0201_Silk]  (hidden comment: CRCW02010000Z0ED)
R65  ValueDisplayed: 0  [0201_Silk]  (hidden comment: CRCW02010000Z0ED)
R66  ValueDisplayed: 0  [0201_Silk]  (hidden comment: CRCW02010000Z0ED)
R67  ValueDisplayed: 0  [0201_Silk]  (hidden comment: CRCW02010000Z0ED)
R69  ValueDisplayed: 0  [0201_Silk]  (hidden comment: CRCW02010000Z0ED)
R70  ValueDisplayed: 0  [0201_Silk]  (hidden comment: CRCW02010000Z0ED)
R71  ValueDisplayed: 0  [0201_Silk]  (hidden comment: CRCW02010000Z0ED)
R75  ValueDisplayed: 0  [0201_Silk]  (hidden comment: CRCW02010000Z0ED)
R111  ValueDisplayed: 0  [0201_Silk]  (hidden comment: CRCW02010000Z0ED)

### Ports
AR_HOSTINTR1, AR_LVDS_VALID_N, AR_LVDS_VALID_P, AR_LVDSCSI0_N, AR_LVDSCSI0_P, AR_LVDSCSI1_N, AR_LVDSCSI1_P, AR_LVDSCSI2_N, AR_LVDSCSI2_P, AR_LVDSCSI3_N, AR_LVDSCSI3_P, AR_LVDSCSI_CLK_N, AR_LVDSCSI_CLK_P, AR_LVDSCSI_FRCLK_N, AR_LVDSCSI_FRCLK_P, AR_NERR_OUT, AR_NRST_MCU, AR_OSC_CLKOUT, AR_RS232RX, AR_RS232TX, AR_SCL, AR_SDA, AR_SYNC_IN, AR_TCK, AR_TDI, AR_TDO_SOP0, AR_TMS, CS1, MISO1, MOSI1, PGOOD, SPICLK1, XDSET_TCK, XDSET_TDI, XDSET_TDO, XDSET_TMS

### Nets
5V_IN: R34.2
GND: J1.18 J1.24 J1.30 J1.36 J1.42 J1.48 J1.54 J1.60 J1.MP1 J1.MP2 J1.MP3 J1.MP4 J2.2 J2.3
AR_HOSTINTR1: R64.2 ; port AR_HOSTINTR1
AR_LVDS_VALID_N: R60.2 ; port AR_LVDS_VALID_N
AR_LVDS_VALID_P: R61.2 ; port AR_LVDS_VALID_P
AR_LVDSCSI0_N: R48.2 ; port AR_LVDSCSI0_N
AR_LVDSCSI0_P: R49.2 ; port AR_LVDSCSI0_P
AR_LVDSCSI1_N: R50.2 ; port AR_LVDSCSI1_N
AR_LVDSCSI1_P: R51.2 ; port AR_LVDSCSI1_P
AR_LVDSCSI2_N: R54.2 ; port AR_LVDSCSI2_N
AR_LVDSCSI2_P: R55.2 ; port AR_LVDSCSI2_P
AR_LVDSCSI3_N: R56.2 ; port AR_LVDSCSI3_N
AR_LVDSCSI3_P: R57.2 ; port AR_LVDSCSI3_P
AR_LVDSCSI_CLK_N: R52.2 ; port AR_LVDSCSI_CLK_N
AR_LVDSCSI_CLK_P: R53.2 ; port AR_LVDSCSI_CLK_P
AR_LVDSCSI_FRCLK_N: R58.2 ; port AR_LVDSCSI_FRCLK_N
AR_LVDSCSI_FRCLK_P: R59.2 ; port AR_LVDSCSI_FRCLK_P
AR_NERR_OUT: R7.2 ; port AR_NERR_OUT
AR_NRST_MCU: R20.1 ; port AR_NRST_MCU
AR_OSC_CLKOUT: R111.1 ; port AR_OSC_CLKOUT
AR_RS232RX: R33.1 ; port AR_RS232RX
AR_RS232TX: R21.1 ; port AR_RS232TX
AR_SCL: R22.1 ; port AR_SCL
AR_SDA: R23.1 ; port AR_SDA
AR_SYNC_IN: R62.2 ; port AR_SYNC_IN
AR_TCK: R66.2 R70.1 ; port AR_TCK
AR_TDI: R29.1 R30.1 ; port AR_TDI
AR_TDO_SOP0: R67.2 R71.1 ; port AR_TDO_SOP0
AR_TMS: R65.2 R69.1 ; port AR_TMS
CS1: R17.1 ; port CS1
HD_LVDS_VALID_N: J1.22 R60.1
HD_LVDS_VALID_P: J1.20 R61.1
HD_LVDSCSI0_N: J1.58 R48.1
HD_LVDSCSI0_P: J1.56 R49.1
HD_LVDSCSI1_N: J1.52 R50.1
HD_LVDSCSI1_P: J1.50 R51.1
HD_LVDSCSI2_N: J1.40 R54.1
HD_LVDSCSI2_P: J1.38 R55.1
HD_LVDSCSI3_N: J1.34 R56.1
HD_LVDSCSI3_P: J1.32 R57.1
HD_LVDSCSI_CLK_N: J1.46 R52.1
HD_LVDSCSI_CLK_P: J1.44 R53.1
HD_LVDSCSI_FRCLK_N: J1.28 R58.1
HD_LVDSCSI_FRCLK_P: J1.26 R59.1
MISO1: R63.2 ; port MISO1
MOSI1: R28.1 ; port MOSI1
PGOOD: R27.1 ; port PGOOD
SPICLK1: R75.1 ; port SPICLK1
XDSET_TCK: R70.2 ; port XDSET_TCK
XDSET_TDI: R30.2 ; port XDSET_TDI
XDSET_TDO: R71.2 ; port XDSET_TDO
XDSET_TMS: R69.2 ; port XDSET_TMS
NetJ1_1: J1.1 J1.2 J1.3 R34.1
NetJ1_4: J1.4 R67.1
NetJ1_5: J1.5 R29.2
NetJ1_6: J1.6 R66.1
NetJ1_7: J1.7 R17.2
NetJ1_8: J1.8 R65.1
NetJ1_9: J1.9 R75.2
NetJ1_10: J1.10 R64.1
NetJ1_11: J1.11 R28.2
NetJ1_12: J1.12 R63.1
NetJ1_13: J1.13 R27.2
NetJ1_14: J1.14 R7.1
NetJ1_16: J1.16 R62.1
NetJ1_51: J1.51 R23.2
NetJ1_53: J1.53 R22.2
NetJ1_55: J1.55 R33.2
NetJ1_57: J1.57 R21.2
NetJ1_59: J1.59 R20.2
NetJ2_1: J2.1 R111.2

Not connected (* = marked no-connect by the designer): J1 15* 17* 19* 21* 23* 25* 27* 29* 31* 33* 35* 37* 39* 41* 43* 45* 47* 49*

### Layout directives
net class GENERAL: (no net found under the mark), NetJ1_13, NetJ1_14, NetJ1_16
net class JTAG: (no net found under the mark), NetJ1_4, NetJ1_5, NetJ1_6, NetJ1_8
net class LVDS: HD_LVDS_VALID_N, HD_LVDS_VALID_P, HD_LVDSCSI0_N, HD_LVDSCSI0_P, HD_LVDSCSI1_N, HD_LVDSCSI1_P, HD_LVDSCSI2_N, HD_LVDSCSI2_P, HD_LVDSCSI3_N, HD_LVDSCSI3_P, HD_LVDSCSI_CLK_N, HD_LVDSCSI_CLK_P, HD_LVDSCSI_FRCLK_N, HD_LVDSCSI_FRCLK_P
net class CLK: NetJ2_1
net class SPI: NetJ1_7, NetJ1_9, NetJ1_10, NetJ1_11, NetJ1_12
differential pair: AR_LVDS_VALID_N, AR_LVDS_VALID_P, AR_LVDSCSI0_N, AR_LVDSCSI0_P, AR_LVDSCSI1_N, AR_LVDSCSI1_P, AR_LVDSCSI2_N, AR_LVDSCSI2_P, AR_LVDSCSI3_N, AR_LVDSCSI3_P, AR_LVDSCSI_CLK_N, AR_LVDSCSI_CLK_P, AR_LVDSCSI_FRCLK_N, AR_LVDSCSI_FRCLK_P, HD_LVDS_VALID_N, HD_LVDS_VALID_P, HD_LVDSCSI0_N, HD_LVDSCSI0_P, HD_LVDSCSI1_N, HD_LVDSCSI1_P, HD_LVDSCSI2_N, HD_LVDSCSI2_P, HD_LVDSCSI3_N, HD_LVDSCSI3_P, HD_LVDSCSI_CLK_N, HD_LVDSCSI_CLK_P, HD_LVDSCSI_FRCLK_N, HD_LVDSCSI_FRCLK_P

### Notes on the sheet
- HD CONNECTOR FOR LVDS/CSI AND JTAG
- JTAG
- Drawn By:
- SVN Rev:
- Number:
- TID #:
- Orderable:
- Rev:
- Sheet Title:
- File:
- Project Title:
- Designed for:
- Assembly Variant:
- Mod. Date:
- Sheet:
- Size:
- of
- B
- http://www.ti.com
- Texas Instruments and/or its licensors do not warrant the accuracy or completeness of this specification or any information contained therein. Texas Instruments and/or its licensors do not warrant that this design will meet the specifications, will be suitable for your application or fit for any particular purpose, or will operate in an implementation. Texas Instruments and/or its licensors do not warrant that the design is production worthy. You should completely validate and test your design implementation to confirm the system functionality for your application.
- Engineer:
- Contact:
- © Texas Instruments

### Library data of the parts
J1 = CMP-0075524-1: Receptacle, 0.5 mm, 30x2, Gold, TH; Manufacturer: Samtec; Pitch_mm: 0.5; Gender: Female; Green_REACh: Passed; CT: False; Shrouded: N; RowSpacing_mm: 5.73; Green_Lifecycle: Active; Row_Count: 2; ComponentLink1Description: Datasheet URL; RoHS: Y; Supplier Part Number 3: 1667876; Supplier 1: Digi-Key; Orientation: Vertical; Green_EU RoHS: Passed with Exemption; PackageReference: Receptacle, 0.5 mm, 30x2, TH; Color: Black; PartNumber: QSH-030-01-L-D-A; PinCount: 60; Publisher: Texas Instruments; Supplier Part Number 2: 19M9181; ContactFinish: Gold; Supplier 2: Newark; ComponentLink1URL: http://www.samtec.com/ftppub/cpdf/QSH-XXX-01-X-D-XX-MKT.pdf; LatestRevisionDate: 2017-07-12; CompType: Receptacle; CNHeader: False; MountType: SMT; Supplier Part Number 1: SAM8180-ND; Supplier 3: Farnell; Green_EU RoHS-2: Passed
J2 = CMP-0055788-1: UMC Straight Jack Receptacle, 50 Ohm, Gold, SMT; Manufacturer: Cinch Connectivity; CNHeader: FALSE; Gender: Female; ComponentLink1URL: https://cinchconnectivity.com/OA_MEDIA/catalog/pdf_UMCCatalogcatalog.pdf; Supplier Part Number 2: 99M0460; Publisher: Texas Instruments; Supplier 2: Newark; Supplier Part Number 3: 530-1280711201; Supplier 3: Mouser; RoHS: Y; MountType: SMT; Supplier 1: Digi-Key; PackageReference: UMC Straight Jack Receptacle, SMT; PinCount: 3; CompType: Jack; LatestRevisionDate: 26/05/2017; PartNumber: 128-0711-201; Orientation: Vertical; ComponentLink1Description: Datasheet URL; Supplier Part Number 1: J983CT-ND; ContactFinish: Gold; CT: FALSE
R7 R17 R20-R23 R27-R30 R33 R48-R67 R69-R71 R75 R111 = CMP-0027008-4: RES, 0, 5%, 0.05 W, 0201; Manufacturer: Vishay-Dale; Power_W: 50mW; TempCo: ppm/C; Value_Code: 0000; Value: 0; EIA_Code: E24; SizeX_mm: 0.6; SizeY_mm: 0.3; SizeZ_mm: 0.26; Value2: 0.05W; SizeArea_mm2: 0.18; AEC Qualified: N; AEC Category: Q200; RoHS: E; Value1: 5%; MountType: SMT; Supplier 1: Newark; PackageReference: 0201; Tolerance_%: 5%; Res_ohm: 0; CompType: Resistor; PartNumber: CRCW02010000Z0ED; ComponentLink1Description: Datasheet link; AEC Grade: N/A; Supplier Part Number 1: 72M6743; Technology: Thick Film; ComponentLink1URL: http://www.vishay.com/docs/20052/crcw0201e3.pdf
R34 = CMP-0016044-3: RES, 0, 5%, 0.75 W, AEC-Q200 Grade 0, 2010; Manufacturer: Vishay-Dale; Power_W: 750mW; TempCo: ppm/C; Value_Code: 0000; Value: 0; EIA_Code: E24; SizeX_mm: 5; SizeY_mm: 2.5; SizeZ_mm: 1.66; Value2: 0.75W; SizeArea_mm2: 12.5; CompType: Resistor; AEC Qualified: Y; AEC Category: Q200; RoHS: E; Value1: 5%; MountType: SMT; Supplier 1: Digi-Key; PackageReference: 2010; Tolerance_%: 5%; Res_ohm: 0; PartNumber: CRCW20100000Z0EF; ComponentLink1Description: Datasheet link; AEC Grade: 0; Supplier Part Number 1: 541-0.0WCT-ND; Technology: Thick Film; ComponentLink1URL: http://www.vishay.com/docs/20035/dcrcwe3.pdf

## Sheet PROC099A_LP Connector.SchDoc: LP Connector
size 431 x 279 mm; Date: Not shown in title block; ApprovedBy: Not shown in title block; CheckedBy: Not shown in title block; Author: Not shown in title block; CompanyName: Not shown in title block; DrawnBy: Adrian Ozer; Engineer: Not shown in title block; Organization: Not shown in title block; Address1: Not shown in title block; Address2: Not shown in title block; Address3: Not shown in title block; Address4: Not shown in title block; DocumentNumber: 11; Revision: Use project parameter SCH_Rev; SheetNumber: 11; SheetTotal: 16; PageSetup: Record=PageOptions|CenterHorizontal=True|CenterVertical=True|PrintScale=1.00|XCorrection=1.00|YCorrection=1.00|PrintKind=0|BorderSize=5000000|LeftOffset=0|BottomOffset=0|Orientation=2|PaperLength=1000|PaperWidth=1000|Scale=100|PaperSource=15|PrintQuality=600|MediaType=1|DitherType=10|PaperKind=Letter|PrintScaleMode=1; CurrentTime: Not shown in title block; CurrentDate: Not shown in title block; Time: Not shown in title block; DocumentFullPathAndName: Not shown in title block; DocumentName: Not shown in title block; ModifiedDate: Not shown in title block; ImagePath: Not shown in title block
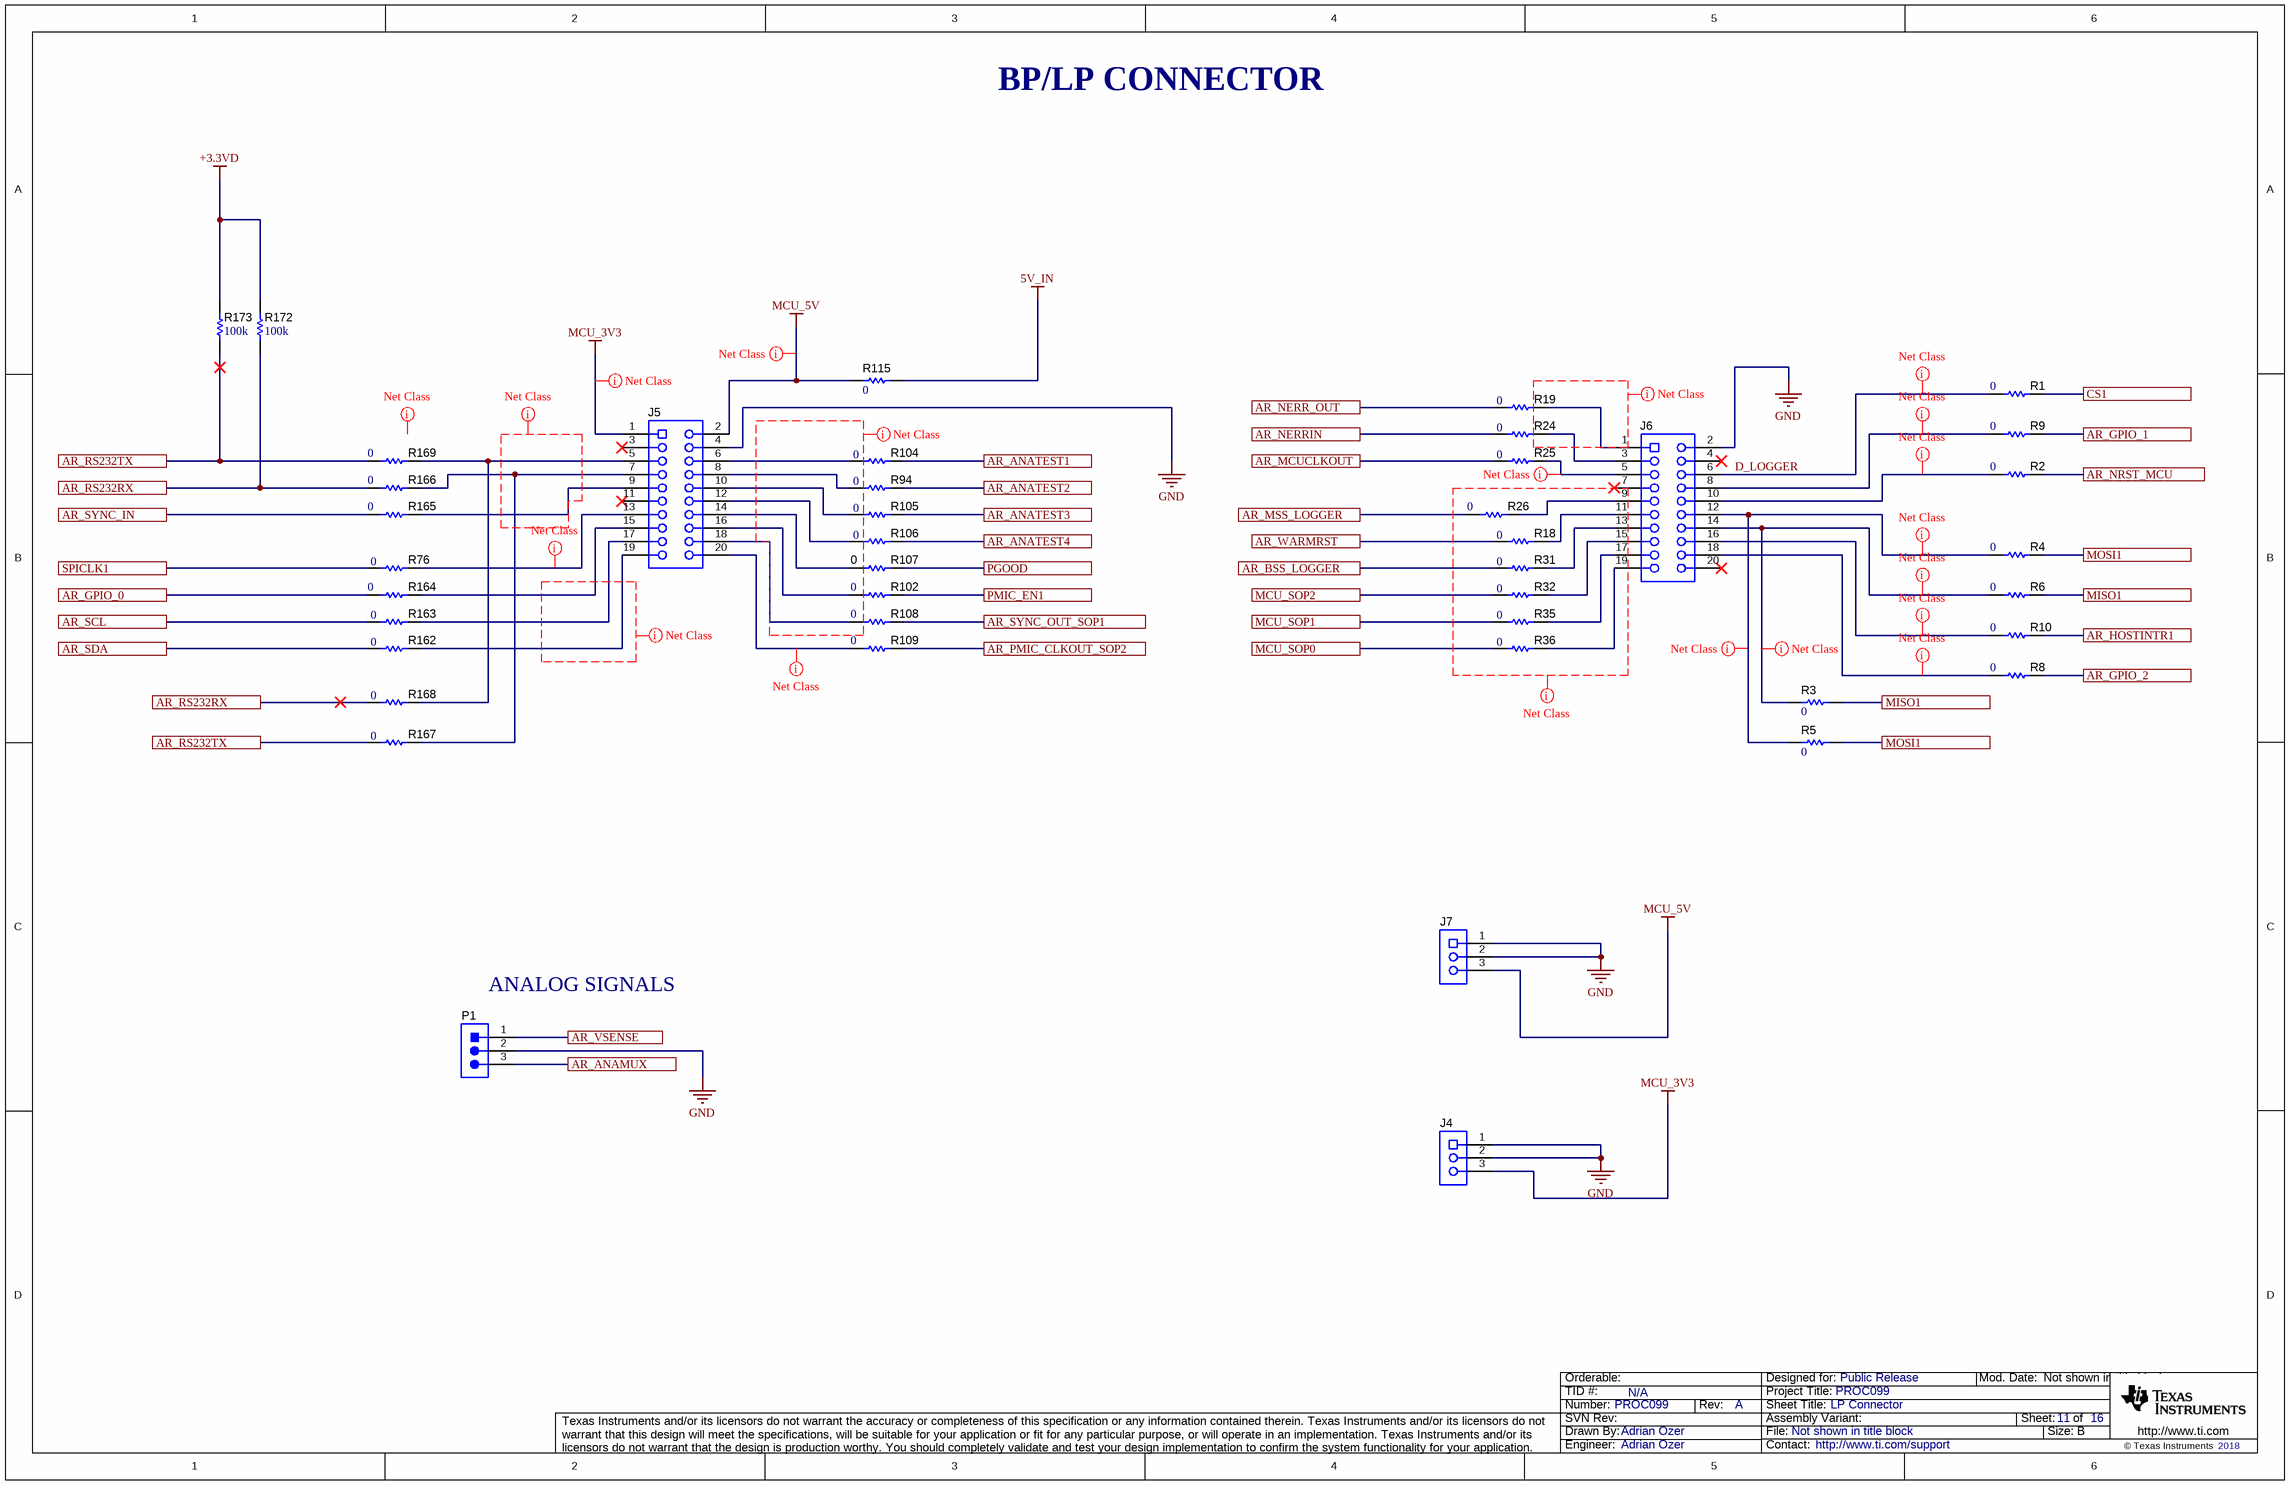
[diagram p7: PROC099A_LP Connector.SchDoc]

### Parts
J4  SSM-103-S-SV  [Samtec_SSM-103-x-SV]  (value not drawn)
J5  SSM-110-S-DV  [Samtec_SSM-110-x-DV]  (value not drawn)
J6  SSM-110-S-DV  [Samtec_SSM-110-x-DV]  (value not drawn)
J7  SSM-103-S-SV  [Samtec_SSM-103-x-SV]  (value not drawn)
P1  TSW-103-07-T-S  [Samtec_TSW-103-07-T-S]  (value not drawn)
R1  ValueDisplayed: 0  [0201_Silk]  (hidden comment: CRCW02010000Z0ED)
R2  ValueDisplayed: 0  [0201_Silk]  (hidden comment: CRCW02010000Z0ED)
R3  ValueDisplayed: 0  [0201_Silk]  (hidden comment: CRCW02010000Z0ED)
R4  ValueDisplayed: 0  [0201_Silk]  (hidden comment: CRCW02010000Z0ED)
R5  ValueDisplayed: 0  [0201_Silk]  (hidden comment: CRCW02010000Z0ED)
R6  ValueDisplayed: 0  [0201_Silk]  (hidden comment: CRCW02010000Z0ED)
R8  ValueDisplayed: 0  [0201_Silk]  (hidden comment: CRCW02010000Z0ED)
R9  ValueDisplayed: 0  [0201_Silk]  (hidden comment: CRCW02010000Z0ED)
R10  ValueDisplayed: 0  [0201_Silk]  (hidden comment: CRCW02010000Z0ED)
R18  ValueDisplayed: 0  [0201_Silk]  (hidden comment: CRCW02010000Z0ED)
R19  ValueDisplayed: 0  [0201_Silk]  (hidden comment: CRCW02010000Z0ED)
R24  ValueDisplayed: 0  [0201_Silk]  (hidden comment: CRCW02010000Z0ED)
R25  ValueDisplayed: 0  [0201_Silk]  (hidden comment: CRCW02010000Z0ED)
R26  ValueDisplayed: 0  [0201_Silk]  (hidden comment: CRCW02010000Z0ED)
R31  ValueDisplayed: 0  [0201_Silk]  (hidden comment: CRCW02010000Z0ED)
R32  ValueDisplayed: 0  [0201_Silk]  (hidden comment: CRCW02010000Z0ED)
R35  ValueDisplayed: 0  [0201_Silk]  (hidden comment: CRCW02010000Z0ED)
R36  ValueDisplayed: 0  [0201_Silk]  (hidden comment: CRCW02010000Z0ED)
R76  ValueDisplayed: 0  [0201_Silk]  (hidden comment: CRCW02010000Z0ED)
R94  ValueDisplayed: 0  [0201_Silk]  (hidden comment: CRCW02010000Z0ED)
R102  ValueDisplayed: 0  [0201_Silk]  (hidden comment: CRCW02010000Z0ED)
R104  ValueDisplayed: 0  [0201_Silk]  (hidden comment: CRCW02010000Z0ED)
R105  ValueDisplayed: 0  [0201_Silk]  (hidden comment: CRCW02010000Z0ED)
R106  ValueDisplayed: 0  [0201_Silk]  (hidden comment: CRCW02010000Z0ED)
R107  ValueDisplayed: 0  [0402L]  (hidden comment: ERJ-2GE0R00X)
R108  ValueDisplayed: 0  [0201_Silk]  (hidden comment: CRCW02010000Z0ED)
R109  ValueDisplayed: 0  [0201_Silk]  (hidden comment: CRCW02010000Z0ED)
R115  ValueDisplayed: 0  [2010]  (hidden comment: CRCW20100000Z0EF)
R162  ValueDisplayed: 0  [0201_Silk]  (hidden comment: CRCW02010000Z0ED)
R163  ValueDisplayed: 0  [0201_Silk]  (hidden comment: CRCW02010000Z0ED)
R164  ValueDisplayed: 0  [0201_Silk]  (hidden comment: CRCW02010000Z0ED)
R165  ValueDisplayed: 0  [0201_Silk]  (hidden comment: CRCW02010000Z0ED)
R166  ValueDisplayed: 0  [0201_Silk]  (hidden comment: CRCW02010000Z0ED)
R167  ValueDisplayed: 0  [0201_Silk]  (hidden comment: CRCW02010000Z0ED)
R168  ValueDisplayed: 0  [0201_Silk]  (hidden comment: CRCW02010000Z0ED)
R169  ValueDisplayed: 0  [0201_Silk]  (hidden comment: CRCW02010000Z0ED)
R172  ValueDisplayed: 100k  [0402L]  (hidden comment: CRCW0402100KFKED)
R173  ValueDisplayed: 100k  [0402L]  (hidden comment: CRCW0402100KFKED)

### Ports
AR_ANAMUX, AR_ANATEST1, AR_ANATEST2, AR_ANATEST3, AR_ANATEST4, AR_BSS_LOGGER, AR_GPIO_0, AR_GPIO_1, AR_GPIO_2, AR_HOSTINTR1, AR_MCUCLKOUT, AR_MSS_LOGGER, AR_NERR_OUT, AR_NERRIN, AR_NRST_MCU, AR_PMIC_CLKOUT_SOP2, AR_RS232RX, AR_RS232TX, AR_SCL, AR_SDA, AR_SYNC_IN, AR_SYNC_OUT_SOP1, AR_VSENSE, AR_WARMRST, CS1, MCU_SOP0, MCU_SOP1, MCU_SOP2, MISO1, MOSI1, PGOOD, PMIC_EN1, SPICLK1

### Nets
5V_IN: R115.2
+3.3VD: R172.2 R173.2
GND: J4.1 J4.2 J5.4 J6.2 J7.1 J7.2 P1.2
MCU_3V3: J4.3 J5.1
MCU_5V: J5.2 J7.3 R115.1
AR_ANAMUX: P1.3 ; port AR_ANAMUX
AR_ANATEST1: R104.2 ; port AR_ANATEST1
AR_ANATEST2: R94.2 ; port AR_ANATEST2
AR_ANATEST3: R105.2 ; port AR_ANATEST3
AR_ANATEST4: R106.2 ; port AR_ANATEST4
AR_BSS_LOGGER: R31.1 ; port AR_BSS_LOGGER
AR_GPIO_0: R164.1 ; port AR_GPIO_0
AR_GPIO_1: R9.2 ; port AR_GPIO_1
AR_GPIO_2: R8.2 ; port AR_GPIO_2
AR_HOSTINTR1: R10.2 ; port AR_HOSTINTR1
AR_MCUCLKOUT: R25.1 ; port AR_MCUCLKOUT
AR_MSS_LOGGER: R26.1 ; port AR_MSS_LOGGER
AR_NERR_OUT: R19.1 ; port AR_NERR_OUT
AR_NERRIN: R24.1 ; port AR_NERRIN
AR_NRST_MCU: R2.2 ; port AR_NRST_MCU
AR_PMIC_CLKOUT_SOP2: R109.2 ; port AR_PMIC_CLKOUT_SOP2
AR_RS232RX: R166.1 R168.1 R172.1 ; port AR_RS232RX
AR_RS232TX: R167.1 R169.1 R173.1 ; port AR_RS232TX
AR_SCL: R163.1 ; port AR_SCL
AR_SDA: R162.1 ; port AR_SDA
AR_SYNC_IN: R165.1 ; port AR_SYNC_IN
AR_SYNC_OUT_SOP1: R108.2 ; port AR_SYNC_OUT_SOP1
AR_VSENSE: P1.1 ; port AR_VSENSE
AR_WARMRST: R18.1 ; port AR_WARMRST
CS1: R1.2 ; port CS1
D_LOGGER: J6.6 R1.1
MCU_SOP0: R36.1 ; port MCU_SOP0
MCU_SOP1: R35.1 ; port MCU_SOP1
MCU_SOP2: R32.1 ; port MCU_SOP2
MISO1: R3.2 R6.2 ; port MISO1
MOSI1: R4.2 R5.2 ; port MOSI1
PGOOD: R107.2 ; port PGOOD
PMIC_EN1: R102.2 ; port PMIC_EN1
SPICLK1: R76.1 ; port SPICLK1
NetJ5_5: J5.5 R168.2 R169.2
NetJ5_6: J5.6 R104.1
NetJ5_7: J5.7 R166.2 R167.2
NetJ5_8: J5.8 R94.1
NetJ5_9: J5.9 R165.2
NetJ5_10: J5.10 R105.1
NetJ5_12: J5.12 R106.1
NetJ5_13: J5.13 R76.2
NetJ5_14: J5.14 R107.1
NetJ5_15: J5.15 R164.2
NetJ5_16: J5.16 R102.1
NetJ5_17: J5.17 R163.2
NetJ5_18: J5.18 R108.1
NetJ5_19: J5.19 R162.2
NetJ5_20: J5.20 R109.1
NetJ6_1: J6.1 R19.2
NetJ6_3: J6.3 R24.2
NetJ6_5: J6.5 R25.2
NetJ6_8: J6.8 R9.1
NetJ6_9: J6.9 R26.2
NetJ6_10: J6.10 R2.1
NetJ6_11: J6.11 R18.2
NetJ6_12: J6.12 R4.1 R5.1
NetJ6_13: J6.13 R31.2
NetJ6_14: J6.14 R3.1 R6.1
NetJ6_15: J6.15 R32.2
NetJ6_16: J6.16 R10.1
NetJ6_17: J6.17 R35.2
NetJ6_18: J6.18 R8.1
NetJ6_19: J6.19 R36.2

Not connected (* = marked no-connect by the designer): J5 3* 11*; J6 4* 7* 20*

### Layout directives
net class GENERAL: (no net found under the mark), NetJ6_8, NetJ6_10, NetJ6_18
net class CLK: NetJ5_20, NetJ6_5
net class PWR: MCU_3V3, MCU_5V
net class SPI: D_LOGGER, NetJ5_13, NetJ6_12, NetJ6_14, NetJ6_16

### Notes on the sheet
- BP/LP CONNECTOR
- (near P1) ANALOG SIGNALS
- Drawn By:
- SVN Rev:
- Number:
- TID #:
- Orderable:
- Rev:
- Sheet Title:
- File:
- Project Title:
- Designed for:
- Assembly Variant:
- Mod. Date:
- Sheet:
- Size:
- of
- B
- http://www.ti.com
- Texas Instruments and/or its licensors do not warrant the accuracy or completeness of this specification or any information contained therein. Texas Instruments and/or its licensors do not warrant that this design will meet the specifications, will be suitable for your application or fit for any particular purpose, or will operate in an implementation. Texas Instruments and/or its licensors do not warrant that the design is production worthy. You should completely validate and test your design implementation to confirm the system functionality for your application.
- Engineer:
- Contact:
- © Texas Instruments

### Library data of the parts
J4 J7 = CMP-0078183-1: Receptacle, 2.54mm, 3x1, Gold with Tin tail, SMT; Manufacturer: Samtec; Pitch_mm: 2.54; Gender: Female; Cert_CSA: Y; Voltage_V: 405V; Current_A: 5.2A; Row_Count: 1; CompType: Socket Strip; ComponentLink1Description: Datasheet URL; RoHS: Y; Supplier 1: Digi-Key; Cert_UL: Y; Orientation: Vertical; PackageReference: Receptacle, 2.54mm, 3x1, SMT; Color: Black; PartNumber: SSM-103-S-SV; PinCount: 3; Supplier Part Number 2: 11P7855; ContactFinish: Gold; Supplier 2: Newark; ComponentLink1URL: http://suddendocs.samtec.com/catalog_english/ssm_sm.pdf; MountType: SMT; Supplier Part Number 1: SAM1152-03-ND
J5 J6 = CMP-0078182-1: Receptacle, 2.54mm, 10x2, Gold with Tin tail, SMT; Manufacturer: Samtec; Pitch_mm: 2.54; Gender: Female; Cert_CSA: Y; Voltage_V: 405V; Current_A: 5.2A; Row_Count: 2; CompType: Socket Strip; ComponentLink1Description: Datasheet URL; RoHS: Y; Supplier 1: Digi-Key; Cert_UL: Y; Orientation: Vertical; PackageReference: Receptacle, 2.54mm, 10x2, SMT; Color: Black; PartNumber: SSM-110-S-DV; PinCount: 20; Supplier Part Number 2: 66H7361; ContactFinish: Gold; Supplier 2: Newark; RowSpacing_mm: 2.54; ComponentLink1URL: http://suddendocs.samtec.com/catalog_english/ssm_sm.pdf; MountType: SMT; Supplier Part Number 1: SAM1150-10-ND
P1 = CMP-0075530-2: Header, 2.54 mm, 3x1, Tin, TH; Manufacturer: Samtec; Pitch_mm: 2.54; Cert_VDE: N; Gender: Male; Cert_CSA: Y; Voltage_V: 550V; Green_REACh: Passed; Current_A: 6.3A; Green_Lifecycle: Active; Row_Count: 1; ComponentLink1Description: Datasheet URL; RoHS: Y; Supplier Part Number 3: 2035682; Supplier 1: Digi-Key; Cert_UL: Y; Orientation: Vertical; Green_EU RoHS: Passed; PackageReference: Header, 2.54 mm, 3x1, TH; Color: Black; PartNumber: TSW-103-07-T-S; PinCount: 3; Supplier Part Number 2: 12P1325; ContactFinish: Tin; Supplier 2: Newark; Cert_CULUS: N; Shrouded: N; ClassName: Header; ComponentLink1URL: http://www.samtec.com/ftppub/cpdf/TSW-XXX-XX-XXX-X-XX-XXX-MKT.pdf; CompType: Header; MountType: TH; Supplier Part Number 1: SAM1035-03-ND; Supplier 3: Farnell; Green_EU RoHS-2: Passed
R1-R6 R8-R10 R18 R19 R24-R26 R31 R32 R35 R36 R94 R102 R105 R106 R108 R109 R162-R169 = CMP-0027008-4: as R7 on sheet PROC099A_HD Connector; RoHS: E; Value1: 5%; MountType: SMT; Supplier 1: Newark; PackageReference: 0201; Tolerance_%: 5%; Res_ohm: 0; CompType: Resistor; PartNumber: CRCW02010000Z0ED; ComponentLink1Description: Datasheet link; AEC Grade: N/A; Supplier Part Number 1: 72M6743; Technology: Thick Film; ComponentLink1URL: http://www.vishay.com/docs/20052/crcw0201e3.pdf
R76 R104 = CMP-0027008-4: RES, 0, 5%, 0.05 W, 0201; Manufacturer: Vishay-Dale; Power_W: 50mW; TempCo: ppm/C; Value_Code: 0000; Value: 0; EIA_Code: E24; SizeX_mm: 0.6; SizeY_mm: 0.3; SizeZ_mm: 0.26; Value2: 0.05W; SizeArea_mm2: 0.18; CompType: Resistor; AEC Qualified: N; AEC Category: Q200; RoHS: E; Value1: 5%; MountType: SMT; Supplier 1: Newark; PackageReference: 0201; Tolerance_%: 5%; Res_ohm: 0; PartNumber: CRCW02010000Z0ED; ComponentLink1Description: Datasheet link; AEC Grade: N/A; Supplier Part Number 1: 72M6743; Technology: Thick Film; ComponentLink1URL: http://www.vishay.com/docs/20052/crcw0201e3.pdf
R107 = CMP-0026992-2: as R37 on sheet PROC099A_QSPI_Flash_Reference; Supplier Part Number 2: 65T8307; Publisher: Texas Instruments; Supplier 2: Newark; Supplier Part Number 3: 667-ERJ-2GE0R00X; Supplier 3: Mouser; Published: 2008-06-26; RoHS: Y; Value1: 5%; MountType: SMT; Supplier 1: Digi-Key; PackageReference: 0402; Tolerance_%: 5%; Res_ohm: 0; SizeArea_mm2: 0.5; CompType: Resistor; LatestRevisionDate: 2017-03-09; PartNumber: ERJ-2GE0R00X; AEC Qualified: ?; ComponentLink1Description: Datasheet link; Supplier Part Number 1: P0.0JCT-ND; Technology: Thick Film; ComponentLink1URL: http://www.panasonic.com/industrial/components/pdf/AOA0000CE1.pdf
R115 = CMP-0016044-3: RES, 0, 5%, 0.75 W, AEC-Q200 Grade 0, 2010; Manufacturer: Vishay-Dale; Power_W: 750mW; TempCo: ppm/C; Value_Code: 0000; Value: 0; EIA_Code: E24; SizeX_mm: 5; SizeY_mm: 2.5; SizeZ_mm: 1.66; Value2: 0.75W; SizeArea_mm2: 12.5; AEC Qualified: Y; AEC Category: Q200; RoHS: E; Value1: 5%; MountType: SMT; Supplier 1: Digi-Key; PackageReference: 2010; Tolerance_%: 5%; Res_ohm: 0; CompType: Resistor; PartNumber: CRCW20100000Z0EF; ComponentLink1Description: Datasheet link; AEC Grade: 0; Supplier Part Number 1: 541-0.0WCT-ND; Technology: Thick Film; ComponentLink1URL: http://www.vishay.com/docs/20035/dcrcwe3.pdf
R172 R173 = CMP-0025950-3: RES, 100 k, 1%, 0.063 W, AEC-Q200 Grade 0, 0402; Manufacturer: Vishay-Dale; Power_W: 63mW; TempCo: 100 ppm/C; Value: 100k; EIA_Code: E96; SizeX_mm: 1; SizeY_mm: 0.5; SizeZ_mm: 0.6; Value2: 0.063W; AEC Qualified: Y; VDC_V: 50V; AEC Category: Q200; AEC Grade: 0; Supplier Part Number 2: 52K6607; Supplier 2: Newark; Supplier Part Number 3: 71-CRCW0402-100K-E3; Supplier 3: Mouser; Value_Code: 100k; RoHS: E; Value1: 1%; MountType: SMT; Supplier 1: Digi-Key; PackageReference: 0402; Tolerance_%: 1%; Res_ohm: 100k; SizeArea_mm2: 0.5; CompType: Resistor; PartNumber: CRCW0402100KFKED; ComponentLink1Description: Datasheet link; Supplier Part Number 1: 541-100KLCT-ND; Technology: Thick Film; ComponentLink1URL: http://www.vishay.com/docs/20035/dcrcwe3.pdf